# Altium schematic sheet Change Log.SchDoc
size B; Author: AM; CompanyName: Expatria Technologies; DrawnBy: A.Marles; Engineer: AM; Organization: Expatria Technolgoies; Address1: PO Box 2084; Address3: Merritt, BC V1K 1B8; Address4: Canada; DocumentNumber: 30; Revision: A2; SheetNumber: 26; SheetTotal: 26
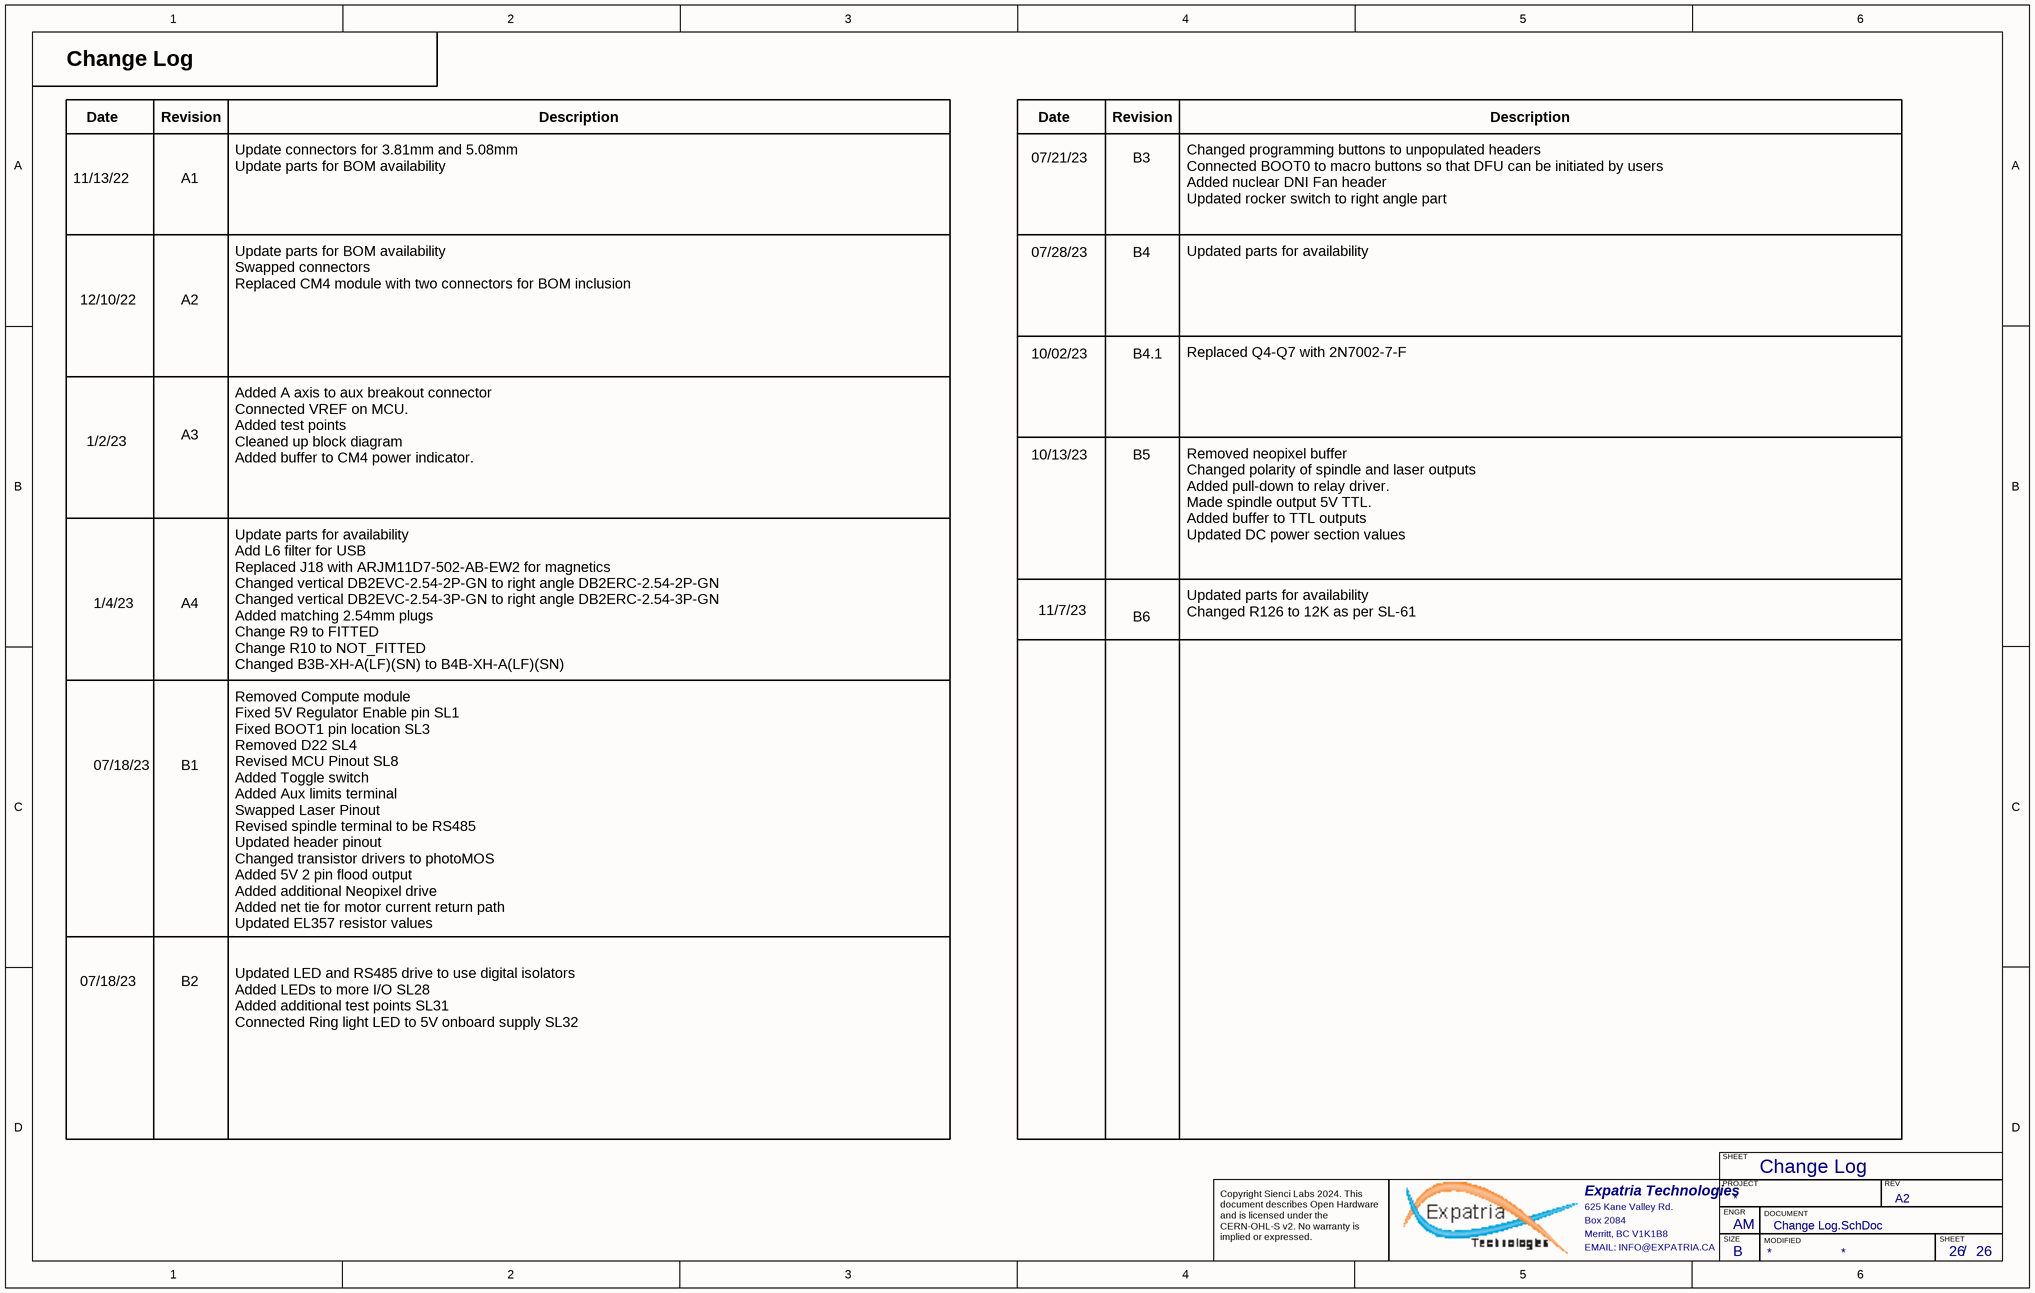
[diagram p0: Change Log.SchDoc]

## Notes on the sheet
- Change Log
- Date
- Revision
- Description
- 07/21/23
- B3
- 11/13/22
- A1
- Update connectors for 3.81mm and 5.08mm
  Update parts for BOM availability
- Changed programming buttons to unpopulated headers
  Connected BOOT0 to macro buttons so that DFU can be initiated by users
  Added nuclear DNI Fan header
  Updated rocker switch to right angle part
- 07/28/23
- B4
- 12/10/22
- A2
- Update parts for BOM availability
  Swapped connectors
  Replaced CM4 module with two connectors for BOM inclusion
- 10/02/23
- B4.1
- Updated parts for availability
- Replaced Q4-Q7 with 2N7002-7-F
- 1/2/23
- A3
- Added A axis to aux breakout connector
  Connected VREF on MCU.
  Added test points
  Cleaned up block diagram
  Added buffer to CM4 power indicator.
- 10/13/23
- B5
- Removed neopixel buffer
  Changed polarity of spindle and laser outputs
  Added pull-down to relay driver.
  Made spindle output 5V TTL.
  Added buffer to TTL outputs
  Updated DC power section values
- 1/4/23
- A4
- 11/7/23
- B6
- Updated parts for availability
  Changed R126 to 12K as per SL-61
- Update parts for availability
  Add L6 filter for USB
  Replaced J18 with ARJM11D7-502-AB-EW2 for magnetics
  Changed vertical DB2EVC-2.54-2P-GN to right angle DB2ERC-2.54-2P-GN
  Changed vertical DB2EVC-2.54-3P-GN to right angle DB2ERC-2.54-3P-GN
  Added matching 2.54mm plugs
  Change R9 to FITTED
  Change R10 to NOT_FITTED
  Changed B3B-XH-A(LF)(SN) to B4B-XH-A(LF)(SN)
- 07/18/23
- B1
- Removed Compute module
  Fixed 5V Regulator Enable pin SL1
  Fixed BOOT1 pin location SL3
  Removed D22 SL4
  Revised MCU Pinout SL8
  Added Toggle switch
  Added Aux limits terminal
  Swapped Laser Pinout
  Revised spindle terminal to be RS485
  Updated header pinout
  Changed transistor drivers to photoMOS
  Added 5V 2 pin flood output
  Added additional Neopixel drive
  Added net tie for motor current return path
  Updated EL357 resistor values
- B2
- Updated LED and RS485 drive to use digital isolators
  Added LEDs to more I/O SL28
  Added additional test points SL31
  Connected Ring light LED to 5V onboard supply SL32
- SHEET
- Expatria Technologies
- 625 Kane Valley Rd.
- Box 2084
- Merritt, BC V1K1B8
- PROJECT
- SIZE
- ENGR
- MODIFIED
- DOCUMENT
- REV
- Copyright Sienci Labs 2024. This document describes Open Hardware and is licensed under the CERN-OHL-S v2. No warranty is implied or expressed.
- EMAIL: INFO@EXPATRIA.CA
- B
- /